# EAGLE design flute (EAGLE 6.1)
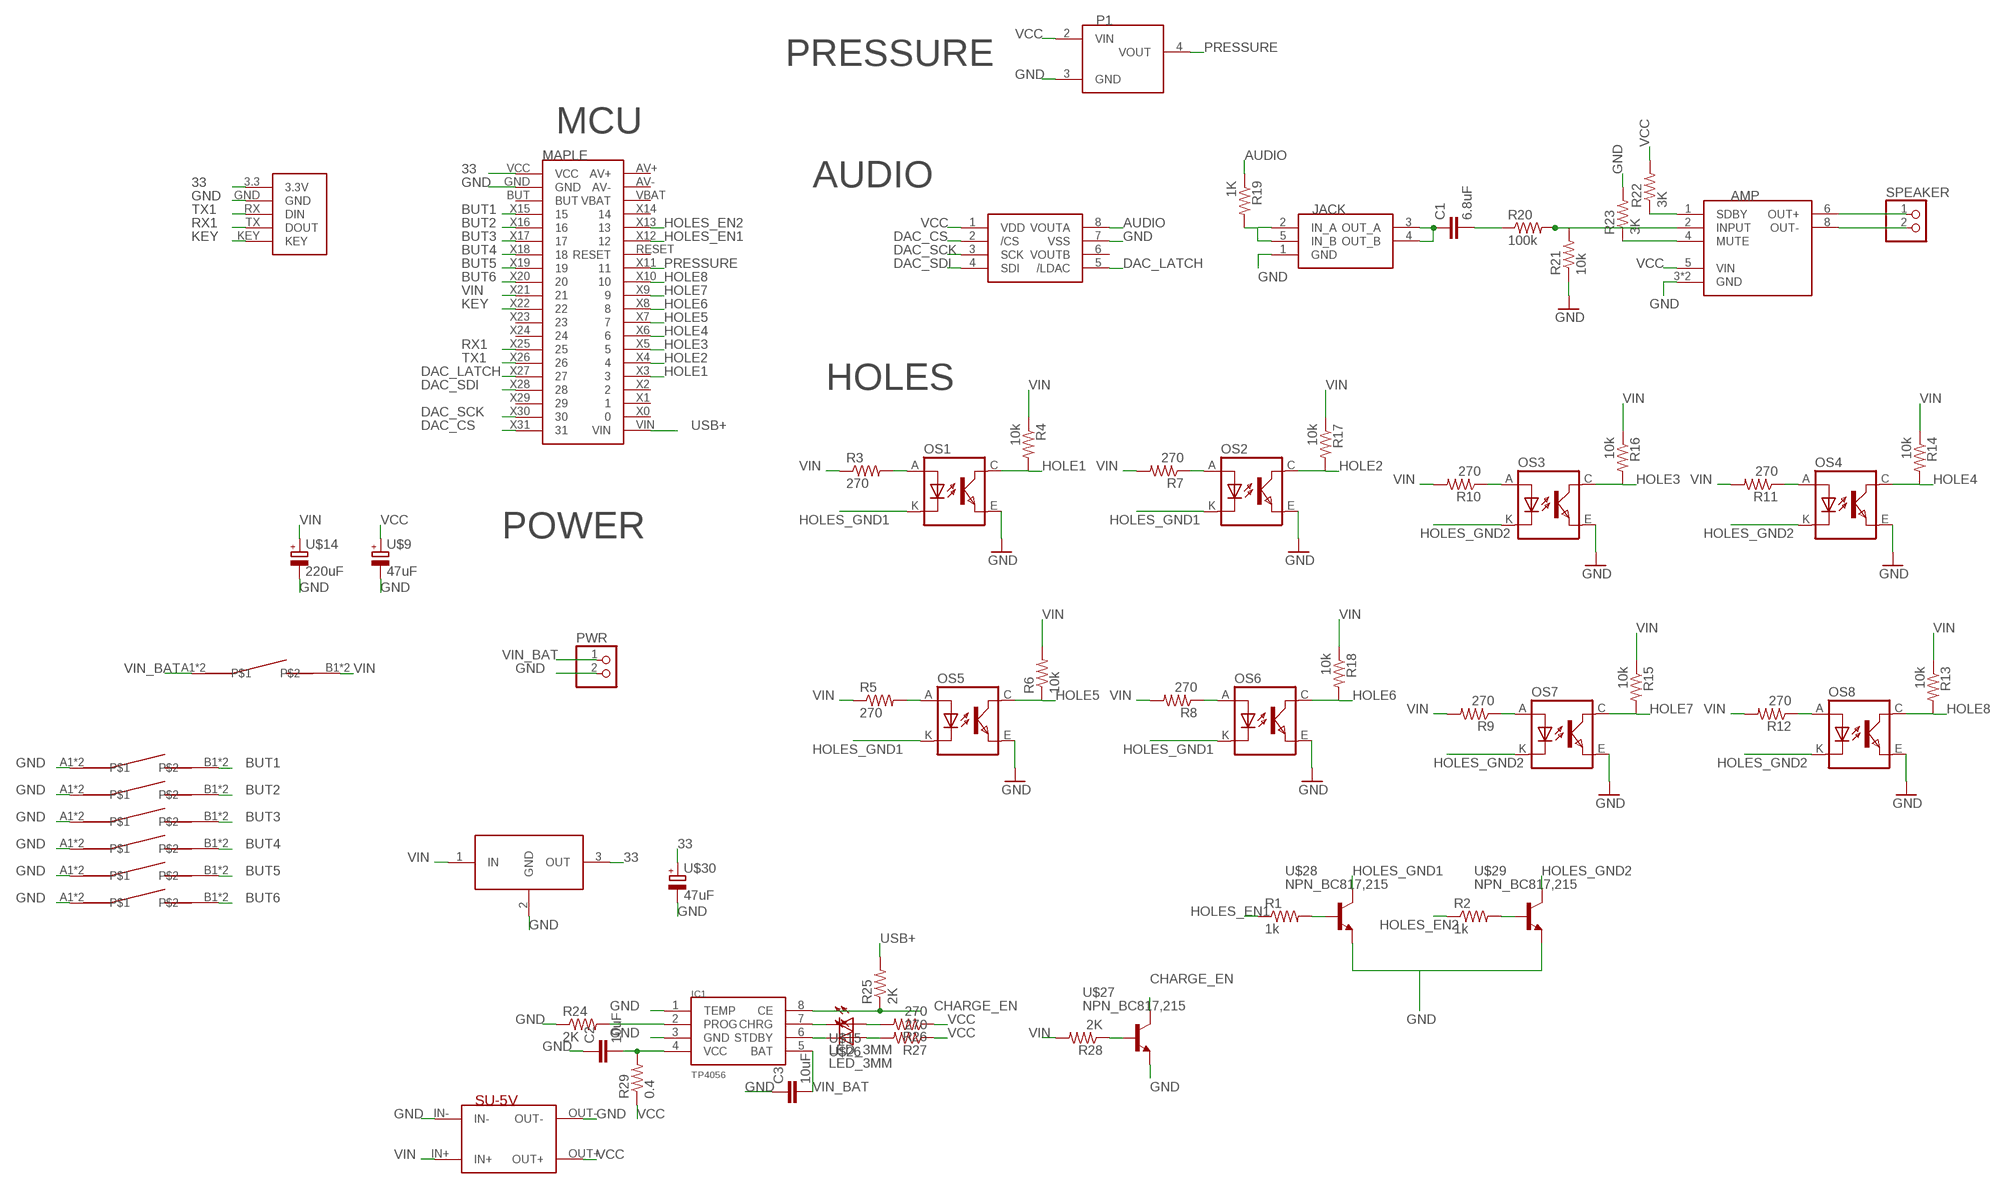
[diagram p0: schematic, sheet 1]

## Parts
AMP  AN7511DIP8  [DIL08]
C1  6.8uF  CAP0805  [0805]
C2  10uF  CAP0805  [0805]
C3  10uF  CAP0805  [0805]
IC1  TP4056  [SOP-8]
JACK  JACK  [3F07]
MAPLE  MAPLE_MINI  [CONNEC_2X20]
OS1  TCRT5000  [TCRT5000]
OS2  TCRT5000  [TCRT5000]
OS3  TCRT5000  [TCRT5000]
OS4  TCRT5000  [TCRT5000]
OS5  TCRT5000  [TCRT5000]
OS6  TCRT5000  [TCRT5000]
OS7  TCRT5000  [TCRT5000]
OS8  TCRT5000  [TCRT5000]
P1  PRESSURE_SENSOR  [MPXV5050GP]
PWR  CONNEC_1X02BASIC  [CONNEC_1X02]
R1  1k  RESISTOR0805-RES  [0805]
R2  1k  RESISTOR0805-RES  [0805]
R3  270  RESISTOR0805-RES  [0805]
R4  10k  RESISTOR0805-RES  [0805]
R5  270  RESISTOR0805-RES  [0805]
R6  10k  RESISTOR0805-RES  [0805]
R7  270  RESISTOR0805-RES  [0805]
R8  270  RESISTOR0805-RES  [0805]
R9  270  RESISTOR0805-RES  [0805]
R10  270  RESISTOR0805-RES  [0805]
R11  270  RESISTOR0805-RES  [0805]
R12  270  RESISTOR0805-RES  [0805]
R13  10k  RESISTOR0805-RES  [0805]
R14  10k  RESISTOR0805-RES  [0805]
R15  10k  RESISTOR0805-RES  [0805]
R16  10k  RESISTOR0805-RES  [0805]
R17  10k  RESISTOR0805-RES  [0805]
R18  10k  RESISTOR0805-RES  [0805]
R19  1K  RESISTOR0805-RES  [0805]
R20  100k  RESISTOR0805-RES  [0805]
R21  10k  RESISTOR0805-RES  [0805]
R22  3K  RESISTOR0805-RES  [0805]
R23  3K  RESISTOR0805-RES  [0805]
R24  2K  RESISTOR0805-RES  [0805]
R25  2K  RESISTOR0805-RES  [0805]
R26  270  RESISTOR0805-RES  [0805]
R27  270  RESISTOR0805-RES  [0805]
R28  2K  RESISTOR0805-RES  [0805]
R29  0.4  RESISTOR0805-RES  [0805]
SPEAKER  CONNEC_1X02BASIC  [CONNEC_1X02]
SU-5V  STEPUP-5V  [STEPUP-5V]
U$9  47uF  CPOL_EUPANASONIC_D  [PANASONIC_D]
U$14  220uF  CPOL_EUPANASONIC_D8  [PANASONIC_D8]
U$15  LED_3MM  [LED3MM]
U$16  SWITCHKCD11  [KCD11]
U$17  MCP4822  RHOBAN_MCP4822  [DIL08]
U$18  SWITCH6X6X10  [SWITCH_6X6X10]
U$19  SWITCH6X6X10  [SWITCH_6X6X10]
U$20  SWITCH6X6X10  [SWITCH_6X6X10]
U$21  SWITCH6X6X10  [SWITCH_6X6X10]
U$22  SWITCH6X6X10  [SWITCH_6X6X10]
U$23  SWITCH6X6X10  [SWITCH_6X6X10]
U$24  HC05  [HC-05]
U$25  MCP1703T-5002EDB  [SOT223]
U$26  LED_3MM  [LED3MM]
U$27  NPN_BC817,215  [SOT-23]
U$28  NPN_BC817,215  [SOT-23]
U$29  NPN_BC817,215  [SOT-23]
U$30  47uF  CPOL_EUPANASONIC_D  [PANASONIC_D]

## Nets
33: MAPLE.VCC U$24.3.3(3.3V) U$25.3(OUT) U$30.+
AUDIO: R19.1 U$17.8(VOUTA)
BUT1: MAPLE.X15 U$18.B1 U$18.B2
BUT2: MAPLE.X16 U$19.B1 U$19.B2
BUT3: MAPLE.X17 U$20.B1 U$20.B2
BUT4: MAPLE.X18 U$21.B1 U$21.B2
BUT5: MAPLE.X19 U$22.B1 U$22.B2
BUT6: MAPLE.X20 U$23.B1 U$23.B2
CHARGE_EN: IC1.8(CE) R25.1 U$27.3(C)
DAC_CS: MAPLE.X31 U$17.2(/CS)
DAC_LATCH: MAPLE.X27 U$17.5(/LDAC)
DAC_SCK: MAPLE.X30 U$17.3(SCK)
DAC_SDI: MAPLE.X28 U$17.4(SDI)
GND [alim]: AMP.3(GND) AMP.7(GND) C2.1 C3.1 IC1.1(TEMP) IC1.3(GND) JACK.1(GND) MAPLE.GND OS1.E(EMITTER) OS2.E(EMITTER) OS3.E(EMITTER) OS4.E(EMITTER) OS5.E(EMITTER) OS6.E(EMITTER) OS7.E(EMITTER) OS8.E(EMITTER) P1.3(GND) PWR.2 R21.1 R23.2 R24.1 SU-5V.IN- SU-5V.OUT- U$9.- U$14.- U$17.7(VSS) U$18.A1 U$18.A2 U$19.A1 U$19.A2 U$20.A1 U$20.A2 U$21.A1 U$21.A2 U$22.A1 U$22.A2 U$23.A1 U$23.A2 U$24.GND U$25.2(GND) U$27.2(E) U$28.2(E) U$29.2(E) U$30.-
HOLE1: MAPLE.X3 OS1.C(COLLECTOR) R4.2
HOLE2: MAPLE.X4 OS2.C(COLLECTOR) R17.2
HOLE3: MAPLE.X5 OS3.C(COLLECTOR) R16.2
HOLE4: MAPLE.X6 OS4.C(COLLECTOR) R14.2
HOLE5: MAPLE.X7 OS5.C(COLLECTOR) R6.1
HOLE6: MAPLE.X8 OS6.C(COLLECTOR) R18.2
HOLE7: MAPLE.X9 OS7.C(COLLECTOR) R15.2
HOLE8: MAPLE.X10 OS8.C(COLLECTOR) R13.2
HOLES_EN1: MAPLE.X12 R1.1
HOLES_EN2: MAPLE.X13 R2.1
HOLES_GND1: OS1.K(CATHODE) OS2.K(CATHODE) OS5.K(CATHODE) OS6.K(CATHODE) U$28.3(C)
HOLES_GND2: OS3.K(CATHODE) OS4.K(CATHODE) OS7.K(CATHODE) OS8.K(CATHODE) U$29.3(C)
KEY: MAPLE.X22 U$24.KEY
N$1: AMP.6(OUT+) SPEAKER.1
N$2: AMP.8(OUT-) SPEAKER.2
N$3: R1.2 U$28.1(B)
N$4: R2.2 U$29.1(B)
N$5: OS1.A(ANODE) R3.2
N$6: R27.2 U$26.A
N$7: OS2.A(ANODE) R7.1
N$8: JACK.2(IN_A) JACK.5(IN_B) R19.2
N$9: OS3.A(ANODE) R10.1
N$10: AMP.4(MUTE) R23.1
N$11: OS4.A(ANODE) R11.1
N$12: C1.2 R20.1
N$13: OS5.A(ANODE) R5.2
N$14: AMP.1(SDBY) R22.1
N$15: OS6.A(ANODE) R8.1
N$16: R26.2 U$15.A
N$17: OS7.A(ANODE) R9.1
N$18: AMP.2(INPUT) R20.2 R21.2
N$19: OS8.A(ANODE) R12.1
N$20: C1.1 JACK.3(OUT_A) JACK.4(OUT_B)
N$21: IC1.2(PROG) R24.2
N$22: R28.1 U$27.1(B)
N$23: C2.2 IC1.4(VCC) R29.2
N$24: IC1.7(CHRG) U$15.K(C)
N$25: IC1.6(STDBY) U$26.K(C)
PRESSURE: MAPLE.X11 P1.4(VOUT)
RX1: MAPLE.X25 U$24.TX(DOUT)
TX1: MAPLE.X26 U$24.RX(DIN)
USB+: MAPLE.VIN R25.2
VCC [alim]: AMP.5(VIN) P1.2(VIN) R22.2 R26.1 R27.1 R29.1 SU-5V.OUT+ U$9.+ U$17.1(VDD)
VIN [alim]: MAPLE.X21 R3.1 R4.1 R5.1 R6.2 R7.2 R8.2 R9.2 R10.2 R11.2 R12.2 R13.1 R14.1 R15.1 R16.1 R17.1 R18.1 R28.2 SU-5V.IN+ U$14.+ U$16.B1 U$16.B2 U$25.1(IN)
VIN_BAT [alim]: C3.2 IC1.5(BAT) PWR.1 U$16.A1 U$16.A2
Unconnected: MAPLE.AV+ MAPLE.AV- MAPLE.BUT MAPLE.RESET MAPLE.VBAT MAPLE.X0 MAPLE.X1 MAPLE.X2 MAPLE.X14 MAPLE.X23 MAPLE.X24 MAPLE.X29 U$17.6(VOUTB)

## Notes on the sheet
- PRESSURE
- MCU
- AUDIO
- HOLES
- POWER

## Library data of the parts
AMP = rhoban:AN7511
C1-C3 = SparkFun-Passives:CAP: Capacitor Standard 0603 ceramic capacitor, and 0.1" leaded capacitor.
IC1 = TP4056:TP4056
JACK = rhoban:JACK
MAPLE = rhoban:MAPLE_MINI
OS1-OS8 = tcrt5000:TCRT5000
P1 = rhoban:PRESSURE_SENSOR
PWR SPEAKER = rhoban:CONNEC_1X02
R1-R29 = SparkFun-Passives:RESISTOR: Resistor Basic schematic elements and footprints for 0603, 1206, and PTH resistors.
SU-5V = rhoban:STEPUP-5V
U$9 U$14 U$30 = rhoban:CPOL_EU: 47uF: http://fr.farnell.com/panasonic-electronic-components/eee1ca470sp/condensateur-elec-alu-47uf-16v/dp/9696946 220uF: http://fr.farnell.com/panasonic-electronic-components/eeefk1c221xp/condensateur-elec-alu-220uf-16v/dp/1850103
U$15 U$26 = rhoban:LED_3MM
U$16 U$18-U$23 = rhoban:SWITCH
U$17 = rhoban:RHOBAN_MCP4822
U$24 = rhoban:HC05
U$25 = rhoban:MCP1703T-5002EDB
U$27-U$29 = rhoban:NPN

## Net classes
0 default: width 0.305 mm
1 alim: width 0.508 mm, clearance 0.076 mm

## Board
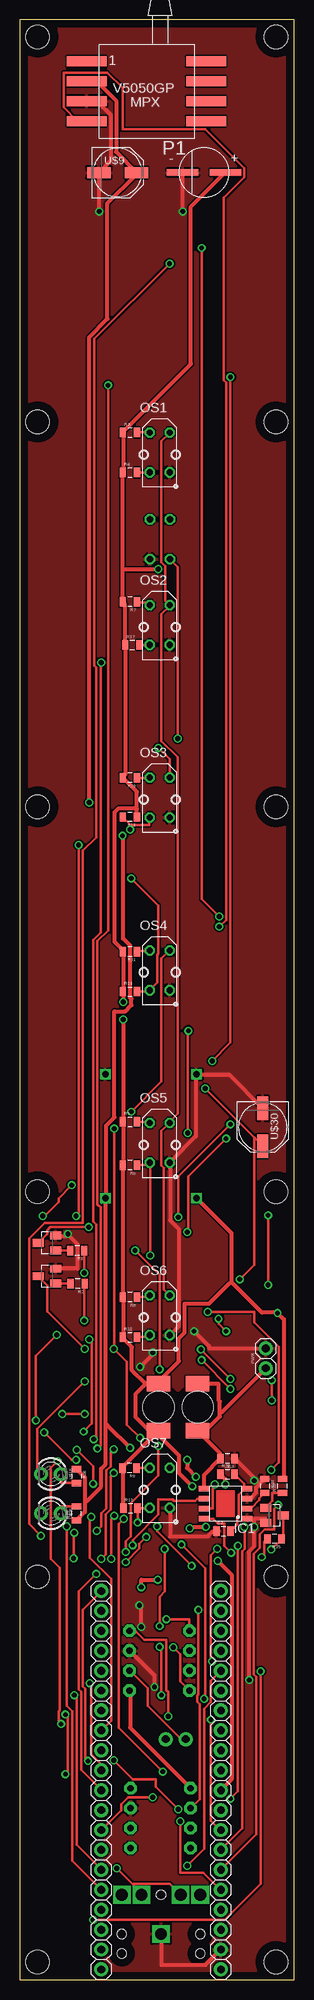
[diagram p1: board, top side]
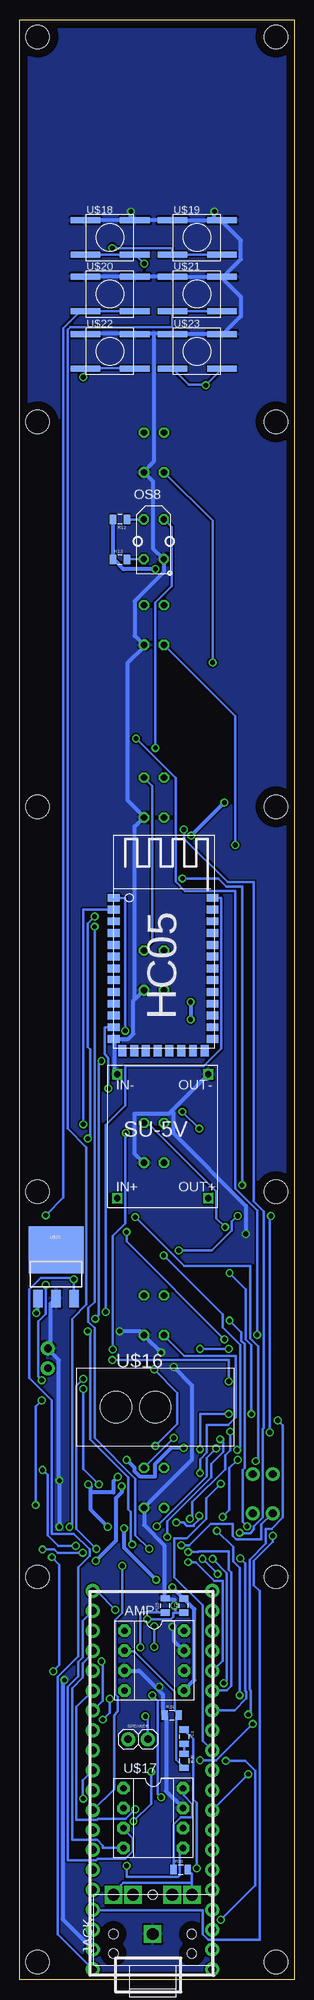
[diagram p2: board, bottom side, seen from below]

Size 35 x 250 mm. Coordinates in mm from the lower left corner, seen from the top.
Outline: 0,0 35,0 35,250 0,250 0,0
Copper layers (1*16): Top 0.035mm / dielectric 1.5mm / Bottom 0.035mm
Design rules: minimum track width 10mil, minimum drill 24mil, track to track 8mil, track to pad 8mil, pad to pad 8mil, via to via 8mil, smd to smd 8mil, copper to edge 40mil, drill to drill 8mil, minimum pad ring 10mil, minimum via ring 8mil, stop-mask expansion 4mil, vias tented up to drill 0mil, thermal gap 10mil

### Footprints (pad centres in the part's own frame; a part is rotated, then mirrored left to right if it is on the bottom)
DIL08 = drill 0.813 pad 1.6 octagon: 1 -3.81,-3.81; 2 -1.27,-3.81; 3 1.27,-3.81; 4 3.81,-3.81; 5 3.81,3.81; 6 1.27,3.81; 7 -1.27,3.81; 8 -3.81,3.81
0805 = smd 0.8 x 1.2: 1 -0.9,0; 2 0.9,0
SOP-8 = smd 1.3 x 0.7: 1 -2.75,1.905; 2 -2.75,0.635; 3 -2.75,-0.635; 4 -2.75,-1.905; 5 2.75,-1.905; 6 2.75,-0.635; 7 2.75,0.635; 8 2.75,1.905
3F07 = drill 1.5 square: 1 0,0; 2 5,5; 3 5,2.5; 4 5,-2.5; 5 5,-5 | hole 1.2: 5,0; 0,-5; -2.5,-5; -2.5,5; 0,5
CONNEC_2X20 = drill 1 pad 1.778: AV+ 0,0; AV- 2.54,0; BUT 5.08,-15.24; GND 2.54,-15.24; RESET 15.24,0; VBAT 5.08,0; VCC 0,-15.24; VIN 48.26,0; X0 45.72,0; X1 43.18,0; X2 40.64,0; X3 38.1,0; X4 35.56,0; X5 33.02,0; X6 30.48,0; X7 27.94,0; X8 25.4,0; X9 22.86,0; X10 20.32,0; X11 17.78,0; X12 12.7,0; X13 10.16,0; X14 7.62,0; X15 7.62,-15.24; X16 10.16,-15.24; X17 12.7,-15.24; X18 15.24,-15.24; X19 17.78,-15.24; X20 20.32,-15.24; X21 22.86,-15.24; X22 25.4,-15.24; X23 27.94,-15.24; X24 30.48,-15.24; X25 33.02,-15.24; X26 35.56,-15.24; X27 38.1,-15.24; X28 40.64,-15.24; X29 43.18,-15.24; X30 45.72,-15.24; X31 48.26,-15.24
TCRT5000 = drill 0.8 octagon: A -2.54,-1.27; C 2.54,-1.27; E 2.54,1.27; K -2.54,1.27
MPXV5050GP = smd 5.08 x 1.27: 1 15.24,0; 2 15.24,2.54; 3 15.24,5.08; 4 15.24,7.62; 5 0,7.62; 6 0,5.08; 7 0,2.54; 8 0,0
CONNEC_1X02 = drill 1 pad 1.778: 1 -1.27,1.27; 2 1.27,1.27
STEPUP-5V = drill 0.8 square: IN+ 1.2,1.2; IN- 1.2,17; OUT+ 12.8,1.2; OUT- 12.8,17
M3_HOLE = hole 3: 0,0
PANASONIC_D = smd 3 x 1.4: + 2.4,0; - -2.4,0
PANASONIC_D8 = smd 4.016 x 0.8: + 2.73,0; - -2.73,0
LED3MM = drill 1 pad 1.778: A -1.27,0; K 1.27,0
KCD11 = smd 3 x 2 bottom: A1 0,3; A2 0,-3; B1 5,3; B2 5,-3 | hole 4: 0,0; 5,0
SWITCH_6X6X10 = smd 3.81 x 0.75: A1 -0.1,5.2; A2 6.2,5.2; B1 -0.1,0.8; B2 6.2,0.8
HC-05 = smd 1.5 x 1: 3.3 0,-16.5; GND 0,-18; KEY 12.6,0; P$3 0,-3; P$4 0,-4.5; P$5 0,-6; P$6 0,-7.5; P$7 0,-9; P$8 0,-10.5; P$9 0,-12; P$10 0,-13.5; P$11 0,-15; P$23 12.6,-1.5; P$24 12.6,-3; P$25 12.6,-4.5; P$26 12.6,-6; P$27 12.6,-7.5; P$28 12.6,-9; P$29 12.6,-10.5; P$30 12.6,-12; P$31 12.6,-13.5; P$32 12.6,-15; P$33 12.6,-16.5; P$34 12.6,-18; RX 0,-1.5; TX 0,0 | smd 1 x 1.5: P$14 1.1,-19.5; P$15 2.6,-19.5; P$16 4.1,-19.5; P$17 5.6,-19.5; P$18 7.1,-19.5; P$19 8.6,-19.5; P$20 10.1,-19.5; P$21 11.6,-19.5
SOT223 = smd 1.219 x 2.235: 1 -2.311,-3.099; 2 0,-3.099; 3 2.311,-3.099 | smd 7 x 6: 4 0,3.099
SOT-23 = smd 1 x 1.4: 1 -0.95,-1.1; 2 0.95,-1.1; 3 0,1.1

### Placement (x,y rotation side)
AMP  17.83,40.71 270 bottom
C1  14.02,31.02 270 bottom
C2  26,57.25 0 top
C3  26.5,66.5 180 top
IC1  26.25,60.75 180 top
JACK  18.03,5.85 90 bottom
MAPLE  10.43,1.33 90 top
OS1  17.87,194.79 270 top
OS2  17.87,172.79 270 top
OS3  17.87,150.79 270 top
OS4  17.87,128.75 270 top
OS5  17.87,106.75 270 top
OS6  17.87,84.75 270 top
OS7  17.87,62.75 270 top
OS8  17.89,183.72 270 bottom
P1  23.78,244.67 180 top
PWR  32.66,79.28 90 top
R1  7.35,93.02 180 top
R2  7.4,88.78 180 top
R3  14.06,197.33 0 top
R4  14.06,192.25 0 top
R5  14.06,109.46 0 top
R6  14.06,103.88 180 top
R7  14.06,175.74 180 top
R8  14.06,87.06 180 top
R9  14.01,65.27 180 top
R10  14.06,153.28 180 top
R11  14.06,131.13 180 top
R12  22.2,186.24 180 bottom
R13  22.2,181.16 0 bottom
R14  14.06,126.05 0 top
R15  14.14,60.18 0 top
R16  14.06,148.3 180 top
R17  14.36,170.26 0 top
R18  14.06,81.98 0 top
R19  14.46,14.08 0 bottom
R20  14.02,27.94 270 bottom
R21  15.6,33.78 0 bottom
R22  14.08,47.73 90 bottom
R23  16.43,47.75 90 bottom
R24  31.25,63 270 top
R25  32.5,56.25 180 top
R26  7.25,64.25 270 top
R27  7.25,59.5 90 top
R28  33.5,63 90 top
R29  26.5,64.5 0 top
SPEAKER  19.9,29.44 0 bottom
SU-5V  23.75,98.5 0 bottom
U$1  [M3_HOLE]  2.3,2.3 0 top
U$2  [M3_HOLE]  2.3,51.4 0 top
U$3  [M3_HOLE]  32.7,2.3 0 top
U$4  [M3_HOLE]  32.7,51.4 0 top
U$5  [M3_HOLE]  2.3,100.5 0 top
U$6  [M3_HOLE]  32.7,100.5 0 top
U$7  [M3_HOLE]  2.3,149.6 0 top
U$8  [M3_HOLE]  32.7,149.6 0 top
U$9  12.5,230.5 0 top
U$10  [M3_HOLE]  2.3,198.7 0 top
U$11  [M3_HOLE]  32.7,198.7 0 top
U$12  [M3_HOLE]  2.3,247.8 0 top
U$13  [M3_HOLE]  32.7,247.8 0 top
U$14  23.5,230.5 0 top
U$15  4,64.5 180 top
U$16  22.7,73.05 0 bottom
U$17  17.97,20.63 270 bottom
U$18  26.5,219.2 0 bottom
U$19  15.4,219.2 0 bottom
U$20  26.5,212 0 bottom
U$21  15.4,212 0 bottom
U$22  26.5,204.7 0 bottom
U$23  15.4,204.7 0 bottom
U$24  23,138 0 bottom
U$25  30.35,90 0 bottom
U$26  4,59.5 180 top
U$27  32.5,59.25 270 top
U$28  3.5,94 90 top
U$29  3.5,89.75 90 top
U$30  31,108.75 270 top

### Tracks (layer width: path | path; a pad name or v marks a point on that pad's centre or on a via)
33  (via drill 0.61)
  Top 0.305: 30,107.36 30.96,106.4 U$30.+ | 30,107.36 v23.68,113.68 | v28.08,89.36 29.92,91.2 29.92,107.28 30,107.36
  Bottom 0.305: v23.68,113.68 23.68,117.6 24.16,118.08 24.16,121.44 23.04,121.44 U$24.3.3 | U$25.3 28.08,86.96 v28.08,89.36 28.16,89.44 28.16,89.52 32.32,89.52 33.76,88.08 33.76,76.8 30.88,73.92 30.88,56.88 28.08,56.88 26.08,54.88 26.08,54.08 27.52,52.64 27.52,41.28 30.16,38.64 30.16,5.84 25.68,1.36 MAPLE.VCC
AUDIO
  Bottom 0.305: R19.1 15.36,19.84 14.48,20.72 12.96,20.72 12.96,22.4 14.08,23.52 14.08,24.4 U$17.8
BUT1  (via drill 0.61)
  Top 0.305: v2.72,56.64 1.2,58.16 1.2,94.56 3.2,96.56 8.08,96.56 8.08,144 9.76,145.68 9.76,167.36 9.52,167.6 9.52,209.28 v19.12,218.88
  Bottom 0.305: v2.72,56.64 2.72,55.84 5.12,53.44 5.12,50.32 4.4,49.6 4.4,5.12 10.96,5.12 11.68,5.84 11.68,8.88 25.6,8.88 MAPLE.X15 | v19.12,218.88 20.24,220 U$18.B2 U$18.B1
BUT2  (via drill 0.61)
  Top 0.305: v20.48,20.24 20.48,13.68 23.44,13.68 25.6,11.52 MAPLE.X16 | v18.24,26.56 12.64,32.16 12.64,58.16 v13.28,58.8 | v8.16,69.92 9.2,70.96 9.2,81.36 v8.88,81.68 | v21.36,95.36 21.52,95.52 21.52,102.48 v26.32,107.28 | v25.44,135.6 23.2,137.84 v23.2,220.88
  Bottom 0.305: v20.48,20.24 18.24,22.48 v18.24,26.56 | v13.28,58.8 12.96,59.12 12.96,60.96 8.8,65.12 8.8,66.88 8.16,67.52 v8.16,69.92 | v8.88,81.68 21.36,94.16 v21.36,95.36 | v26.32,107.28 26,107.6 26,118.64 26.32,118.96 26.32,134.72 v25.44,135.6 | v23.2,220.88 15.52,220.88 15.52,220 U$19.B1 U$19.B2
BUT3  (via drill 0.61)
  Top 0.305: v32.96,60.56 32.48,60.08 32.48,57.44 31.28,57.44 30.64,56.8 30.64,55.12 29.84,54.32 29.84,38.96 30.16,38.64 30.16,18.56 25.68,14.08 MAPLE.X17 | v32.16,76.48 v32.16,73.92 | v31.68,97.52 v31.68,88.64
  Bottom 0.305: v32.96,60.56 32.96,73.12 v32.16,73.92 | v32.16,76.48 32.64,76.96 32.64,84 31.68,84.96 v31.68,88.64 | v31.68,97.52 29.44,99.76 29.44,210.64 27.28,212.8 U$20.B1 U$20.B2
BUT4  (via drill 0.61)
  Top 0.305: v28.64,57.76 28.72,57.68 28.72,54.96 28.4,54.64 28.4,19.36 25.68,16.64 MAPLE.X18
  Bottom 0.305: v28.64,57.76 28.32,58.08 28.32,84.32 26.48,86.16 26.48,106.16 28.88,108.56 28.88,210.48 28.56,210.8 15.52,210.8 15.52,212.8 U$21.B1 U$21.B2
BUT5  (via drill 0.61)
  Top 0.305: v24.4,33.2 24.4,20.32 25.6,19.12 MAPLE.X19 | v23.52,35.84 23.68,36 23.68,52.48 v20.64,55.52 | v26.32,82.72 25.36,83.68 v25.36,84.32 | v24.56,117.2 26.88,119.52 v26.88,204.4
  Bottom 0.305: v24.4,33.2 23.52,34.08 v23.52,35.84 | v20.64,55.52 20.8,55.68 20.8,59.68 21.12,60 21.12,64.08 26,68.96 26,82.4 v26.32,82.72 | v25.36,84.32 24.88,84.8 24.88,116.88 v24.56,117.2 | v26.88,204.4 26.64,204.64 26.64,205.44 U$22.B1 26.48,205.52 20.32,205.52 U$22.B2
BUT6  (via drill 0.61)
  Top 0.305: v21.92,52.8 17.52,57.2 v17.52,57.84 | v9.92,67.76 10.32,68.16 10.32,98.48 9.92,98.88 9.92,132.48 11.28,133.84 v11.28,203.36
  Bottom 0.305: v21.92,52.8 21.92,46.8 22.8,45.92 22.8,36.4 22.48,36.08 22.48,34.24 22.96,33.76 22.96,24.32 25.6,21.68 MAPLE.X20 | v17.52,57.84 11.12,64.24 11.12,66.56 v9.92,67.76 | U$23.B2 9.2,205.44 v11.28,203.36 11.36,203.44 13.44,203.44 U$23.B1
CHARGE_EN  (via drill 0.61)
  Top 0.305: U$27.3 33.6,56.48 33.44,56.32 R25.1 33.28,56.16 33.28,56.08 v32.08,54.88 | v26.96,54.48 26.08,55.36 26.08,58.24 25.28,58.24 24.72,58.8 23.52,58.8 IC1.8
  Bottom 0.305: v26.96,54.48 30.16,54.48 30.56,54.88 v32.08,54.88
DAC_CS  (via drill 0.61)
  Top 0.305: v22.8,47.2 22.8,36.4 22.64,36.24 22.64,35.44 22.96,35.12 22.96,23.04 21.84,21.92 U$17.2
  Bottom 0.305: v22.8,47.2 25.12,49.52 25.6,49.52 MAPLE.X31
DAC_LATCH  (via drill 0.61)
  Top 0.305: v21.36,14.56 23.52,16.72 23.52,34.56 24.4,35.44 24.4,38.16 25.6,39.36 MAPLE.X27
  Bottom 0.305: v21.36,14.56 21.36,13.12 14.8,13.12 14.56,13.36 14.56,16.4 14.16,16.8 U$17.5
DAC_SCK
  Bottom 0.305: U$17.3 21.76,19.28 20.56,18.08 20.56,16.4 21.52,15.44 25.04,15.44 25.2,15.28 28.88,15.28 28.88,37.36 27.52,38.72 27.52,40.56 26.96,41.12 26.96,45.76 MAPLE.X30
DAC_SDI
  Bottom 0.305: U$17.4 21.84,16.88 24.4,16.88 24.4,17.12 25.12,17.84 28.32,17.84 28.32,37.2 26.96,38.56 26.96,40.4 25.68,41.68 25.68,41.92 MAPLE.X28
GND  (via drill 0.61)
  Top 0.508: MAPLE.GND 25.6,3.84 23.68,1.92 18.08,1.92 18.08,5.84 JACK.1 | 29.92,58.8 31.36,58.8 31.36,58.32 U$27.2 | 29.92,58.8 29.04,58.8 IC1.1 | 30.64,63.28 30.16,62.8 30.16,62.16 29.44,61.44 29.04,61.44 IC1.3 | 30.64,63.28 31.2,63.84 R24.1 | 30.64,63.28 30.08,63.84 | 30.08,63.84 27.44,66.48 C3.1 | 29.92,58.8 v29.92,57.76 29.84,57.52 29.84,55.2 29.2,54.56 29.2,38.32 v29.28,38.24 | v29.92,63.68 30.08,63.84 | P1.3 8.56,239.52 9.92,239.52 11.6,237.84 11.6,232 U$9.- 10.16,230.32 v10.16,225.52 | v20.8,225.52 20.8,230.48 U$14.- | C2.1 25.04,57.2 24.64,57.2 24,56.56 19.2,56.56 19.2,60.16 OS7.E | v17.2,37.36 17.2,38.8 14.08,41.92 AMP.7 | v15.28,47.76 15.52,47.52 v15.52,45.04 | 6.16,94.88 4.64,94.88 U$28.2 | 6.16,94.88 6.32,94.88 7.36,93.84 7.36,90.72 4.64,90.72 U$29.2 | OS6.E 19.2,82.24 20.32,83.36 20.32,95.76 19.2,96.88 19.2,104.16 OS5.E 19.28,104.4 22.48,107.6 22.48,115.2 SU-5V.IN- 22.56,115.44 26.72,115.44 30.96,111.2 U$30.- | v6.16,95.12 6.16,94.88 | v15.36,78.16 16.96,79.76 v16.96,80 | v22.24,82.72 24.16,80.8 24.16,80.56 31.36,80.56 PWR.2
  Bottom 0.508: U$25.2 30.4,86.88 31.04,86.24 31.04,80.88 31.36,80.56 PWR.2 31.28,80.32 30,79.04 30,63.92 v29.92,63.68 v29.92,57.76 | v29.28,38.24 29.52,38 29.52,7.76 25.68,3.92 MAPLE.GND | U$19.A2 U$19.A1 U$18.A2 | U$18.A2 U$18.A1 | v20.8,225.52 20.8,224.64 U$18.A2 | v10.16,225.52 10.16,224.64 U$19.A2 | 17.92,209.92 15.76,209.92 U$23.A1 15.44,209.92 9.2,209.92 U$23.A2 8.96,210 6.8,212.16 6.8,214.64 9.12,216.96 U$21.A2 | 17.92,209.92 20.24,209.92 U$22.A2 20.56,209.92 26.56,209.92 U$22.A1 | U$21.A2 U$21.A1 U$20.A2 U$20.A1 | 17.92,209.92 17.92,193.6 19.04,192.48 OS1.E 19.12,192.24 18,191.12 18,182.56 16.64,181.2 OS8.E 16.64,180.96 16.64,179.52 20.32,175.84 20.32,171.44 19.2,170.32 OS2.E 19.2,170 21.2,168 21.2,150.4 19.28,148.48 OS3.E 19.2,148.24 20.32,147.12 20.32,125.36 20.16,125.2 | U$19.A2 9.12,224.16 6.8,221.84 6.8,219.44 8.96,217.28 U$21.A2 | 17.44,37.12 19.76,39.44 21.6,39.44 AMP.3 | 17.44,37.12 16.72,36.4 16.72,34 16.56,33.84 R21.1 16.32,33.6 16.32,24.08 14.16,21.92 U$17.7 | v17.2,37.36 17.44,37.12 | v15.28,47.76 15.28,48.48 16.24,48.48 R23.2 16.48,48.72 16.56,48.8 16.56,55.44 19.12,58 19.12,60.16 OS7.E 18.96,60.4 13.04,66.32 13.04,75.84 v15.36,78.16 | v15.52,45.04 15.28,44.8 15.28,43.2 14.08,42 AMP.7 | 15.6,110.8 15.92,110.48 20.32,110.48 20.32,105.36 19.2,104.24 OS5.E | 15.6,110.8 10.96,115.44 SU-5V.OUT- | v6.16,95.12 6.16,98.72 15.44,108 15.44,110.64 15.6,110.8 | SU-5V.IN- 22.56,115.52 22.88,115.84 22.88,119.92 22.96,120 U$24.GND 21.12,120 20.48,120.64 20.48,124.88 20.16,125.2 | 20.16,125.2 19.2,126.16 OS4.E | v16.96,80 19.12,82.16 OS6.E 19.28,82.4 19.28,82.72 v22.24,82.72
  pour Top: -12,294.5 69.75,294.5 69.75,-12.5 -36,-12.5 -36,198
  pour Bottom: -25.5,285.25 52.75,285.25 52.75,-18 -70.75,-18 -70.75,205
HOLE1  (via drill 0.61)
  Top 0.305: R4.2 16.56,192.24 OS1.C | v10.4,168 10.32,167.92 10.32,133.6 9.36,132.64 9.36,96.72 9.76,96.32 9.76,69.28 v9.44,68.96 | v16.16,56.48 15.28,55.6 15.28,55.04 v13.52,53.28
  Bottom 0.305: v10.4,168 10.4,186.08 16.56,192.24 OS1.C | v9.44,68.96 9.04,68.56 9.04,67.36 10.56,65.84 10.56,64.08 16.16,58.48 v16.16,56.48 | v13.52,53.28 12.56,53.28 10.16,50.88 9.12,50.88 9.12,40.72 10.4,39.44 MAPLE.X3
HOLE2  (via drill 0.61)
  Top 0.305: R17.2 15.28,170.24 16.56,170.24 OS2.C | v7.52,144.72 7.52,97.76 v7.2,97.44 | v14.72,93.04 17.84,89.92 v17.84,77.84 | v17.68,68.08 17.68,64.32 14.16,60.8 14.16,56.56 13.52,55.92 v13.52,54.56
  Bottom 0.305: v7.52,144.72 7.52,161.2 16.56,170.24 OS2.C | v7.2,97.44 7.92,96.72 7.92,95.6 10.48,93.04 v14.72,93.04 | v17.84,77.84 14.88,74.88 14.88,70.88 v17.68,68.08 | v13.52,54.56 12.24,54.56 12.16,54.64 8.32,54.64 8.32,52.32 8,52 8,37.52 8.56,36.96 10.4,36.96 MAPLE.X4
HOLE3  (via drill 0.61)
  Top 0.305: 14.16,147.28 13.2,148.24 R16.2 | 14.16,147.28 16.56,147.28 16.56,148.24 OS3.C | v14.08,146.72 14.08,147.2 14.16,147.28 | v6.96,57.04 6.88,56.96 v6.88,53.76
  Bottom 0.305: v14.08,146.72 14,146.64 14,145.52 8.48,140 5.12,140 5.12,99.28 3.84,98 3.84,70.4 4,70.24 4,58.96 5.12,57.84 5.12,57.44 5.6,56.96 6.96,56.96 v6.96,57.04 | v6.88,53.76 6.24,53.12 6.24,36.88 6.08,36.72 6.08,35.92 7.6,34.4 10.4,34.4 MAPLE.X5
HOLE4  (via drill 0.61)
  Top 0.305: R14.2 14.96,126.08 16.56,126.08 16.56,126.16 OS4.C 16.64,126.32 17.52,127.2 17.52,130.72 17.68,130.88 17.68,137.04 v14.24,140.48 | v6.64,101.36 4.96,99.68 4.96,99.2 3.2,97.44 v2.96,97.44 | v3.12,69.84 6.64,66.32 v7.2,66.32 | v9.12,59.04 8.96,58.88 8.96,53.84 11.68,51.12 11.68,33.04 10.48,31.84 MAPLE.X6
  Bottom 0.305: v14.24,140.48 9.68,140.48 8.64,139.44 6.64,139.44 v6.64,101.36 | v2.96,97.44 3.12,97.28 v3.12,69.84 | v7.2,66.32 8.24,65.28 8.24,59.92 v9.12,59.04
HOLE5  (via drill 0.61)
  Top 0.305: R6.1 14.96,103.92 16.56,103.92 16.56,104.16 OS5.C 16.64,103.84 v16.64,92.4 | v7.28,67.6 9.36,65.52 v9.36,63.28
  Bottom 0.305: v16.64,92.4 9.12,84.88 9.12,83.2 6.88,80.96 6.88,68 v7.28,67.6 | v9.36,63.28 11.2,61.44 11.2,58.8 13.68,56.32 15.28,56.32 15.28,51.36 11.68,47.76 11.68,30.48 10.48,29.28 MAPLE.X7
HOLE6  (via drill 0.61)
  Top 0.305: R18.2 14.96,82 16.56,82 16.56,82.16 OS6.C | v12,64.64 11.6,64.24 11.6,60 10.96,59.36 10.96,54.24 v10.4,53.68 | v8.96,37.84 9.12,37.68 9.12,28.8 10.4,27.52 10.4,26.8 MAPLE.X8
  Bottom 0.305: v12,64.64 12,66.4 11.12,67.28 11.12,70.8 8.4,70.8 7.44,71.76 7.44,79.6 14,79.6 16.56,82.16 OS6.C | v10.4,53.68 8.56,51.84 8.56,38.24 v8.96,37.84
HOLE7  (via drill 0.61)
  Top 0.305: OS7.C 16.56,60.16 15.12,60.16 R15.2 15.04,60.08 v15.04,58.32 | v12.08,59.2 11.68,58.8 v11.68,53.68 | v9.76,51.76 7.52,49.52 7.52,37.04 7.84,36.72 7.84,26.8 10.4,24.24 MAPLE.X9
  Bottom 0.305: v15.04,58.32 14.08,58.32 13.68,57.92 12.8,57.92 12.8,58 12.08,58.72 v12.08,59.2 | v9.76,51.76 v11.68,53.68
HOLE8  (via drill 0.61)
  Top 0.305: v20.16,158.32 20.16,180.16 19.2,181.12 OS8.C | v4.72,82.24 2.08,79.6 v2.08,71.36 | v5.84,33.84 6.16,33.52 6.16,26.56 v5.84,26.24
  Bottom 0.305: R13.2 21.28,181.2 19.2,181.2 OS8.C | v20.16,158.32 15.12,153.28 15.12,140.08 13.92,138.88 7.52,138.88 7.52,100.96 4.72,98.16 v4.72,82.24 | v2.08,71.36 1.44,70.72 1.44,58.96 2.88,57.52 3.6,57.52 3.6,55.68 5.68,53.6 5.68,37.04 5.52,36.88 5.52,34.16 v5.84,33.84 | v5.84,26.24 10.4,21.68 MAPLE.X10
HOLES_EN1  (via drill 0.61)
  Top 0.305: v8.24,90.16 8.24,92.96 R1.1 | v8.32,72.16 v5.44,72.16 | v12,67.68 11.6,67.28 11.6,65.52 11.04,64.96 11.04,60.16 10.4,59.52 10.4,57.84 v9.84,57.28 | v6.96,36.32 7.28,36 7.28,17.2 10.4,14.08 MAPLE.X12
  Bottom 0.305: v8.24,90.16 6.16,88.08 6.16,81.68 5.44,80.96 v5.44,72.16 | v8.32,72.16 12,72.16 v12,67.68 | v9.84,57.28 7.76,55.2 7.76,53.36 6.96,52.56 v6.96,36.32
HOLES_EN2  (via drill 0.61)
  Top 0.305: v8.24,84.08 8.24,88.72 R2.1 | v6,57.84 6,34.96 6.72,34.24 6.72,15.2 10.4,11.52 MAPLE.X13
  Bottom 0.305: v8.24,84.08 6.72,82.56 6.72,81.52 6.32,81.12 6.32,65.28 6.56,65.04 6.56,58.4 v6,57.84
HOLES_GND1  (via drill 0.61)
  Top 0.305: OS1.K 19.12,197.28 18.08,196.24 18.08,180.8 18.56,180.32 18.56,175.92 19.12,175.36 OS2.K 19.12,175.2 18.08,174.16 18.08,158 20.16,155.92 20.16,110.48 19.12,109.44 OS5.K 19.12,109.28 18.08,108.24 18.08,103.84 18.4,103.52 18.4,88.08 19.12,87.36 OS6.K | U$28.3 3.52,95.12 3.52,95.6 3.92,96 v8.8,96
  Bottom 0.305: v8.8,96 9.92,97.12 9.92,100.56 18.64,109.28 19.12,109.28 OS5.K
HOLES_GND2  (via drill 0.61)
  Top 0.305: v8.32,80.48 3.52,85.28 3.52,88.56 2.4,89.68 U$29.3 | v15.36,69.12 13.68,70.8 13.68,78.8 v12,80.48 12.08,80.56 v12.08,108.56 | v17.68,157.12 19.12,155.68 19.12,153.36 OS3.K | v14.24,110.72 18.08,114.56 18.08,130.24 19.12,131.28 OS4.K
  Bottom 0.305: v12,80.48 v8.32,80.48 | v15.36,69.12 19.12,65.36 OS7.K | OS4.K 19.12,131.36 18.08,132.4 18.08,152.24 19.12,153.28 OS3.K | v17.68,157.12 17.68,175.68 15.6,177.76 15.6,185.28 16.56,186.24 OS8.K | v14.24,110.72 v12.08,108.56
KEY  (via drill 0.61)
  Top 0.305: v24,85.2 29.92,85.2 29.92,83.84 33.04,80.72 33.04,66 v32.08,65.04 | v27.84,55.36 27.84,24.08 v26.88,23.12
  Bottom 0.305: U$24.KEY 9.28,138 9.28,118.8 11.52,116.56 21.52,116.56 21.52,111.52 24,109.04 v24,85.2 | v32.08,65.04 31.44,64.4 31.44,56.72 30.08,55.36 v27.84,55.36 | v26.88,23.12 26.96,23.2 26.96,25.44 MAPLE.X22
N$1
  Top 0.305: AMP.6 14.08,39.44 16.32,37.2 16.32,34.96 20.56,30.72 21.12,30.72 SPEAKER.1
N$2  (via drill 0.61)
  Top 0.305: v18.96,33.6 18.96,36.72 18.72,36.96 18.72,43.36 15.92,43.36 14.8,44.48 14.08,44.48 AMP.8
  Bottom 0.305: v18.96,33.6 18.64,33.28 SPEAKER.2
N$3
  Top 0.305: R1.2 6.4,93.04 4.64,93.04 U$28.1
N$4
  Top 0.305: U$29.1 6.48,88.8 R2.2
N$5
  Top 0.305: R3.2 14.96,197.36 16.56,197.36 OS1.A
N$6
  Top 0.305: R27.2 5.28,60.4 5.28,59.52 U$26.A
N$7
  Top 0.305: R7.1 14.96,175.68 16.56,175.68 16.56,175.36 OS2.A
N$8
  Bottom 0.305: 13.04,12.4 13.04,10.88 JACK.5 | 13.04,12.4 13.04,13.52 13.52,14 R19.2 | 13.04,12.4 21.76,12.4 22.08,12.08 22.08,11.76 22.96,10.88 JACK.2
N$9
  Top 0.305: R10.1 16.56,153.28 OS3.A
N$10  (via drill 0.61)
  Top 0.305: v19.6,42.4 20.48,41.52 20.48,38.08 21.6,36.96 AMP.4
  Bottom 0.305: v19.6,42.4 19.6,46.88 16.48,46.88 R23.1
N$11
  Top 0.305: R11.1 14.96,131.2 16.56,131.2 16.56,131.28 OS4.A
N$12
  Bottom 0.305: R20.1 14,28.88 14,30.08 C1.2
N$13
  Top 0.305: R5.2 14.96,109.44 16.56,109.44 16.56,109.36 OS5.A
N$14  (via drill 0.61)
  Top 0.305: v18.72,46 21.6,46 21.6,44.56 AMP.1
  Bottom 0.305: v18.72,46 15.76,46 15.44,46.32 15.44,46.8 14.08,46.8 R22.1
N$15
  Top 0.305: R8.1 14.96,87.12 16.56,87.12 16.56,87.28 OS6.A
N$16
  Top 0.305: R26.2 7.2,63.36 5.28,63.36 5.28,64.48 U$15.A
N$17
  Top 0.305: R9.1 14.96,65.28 16.56,65.28 OS7.A
N$18
  Bottom 0.305: R20.2 14.08,27.12 15.04,28.08 15.04,33.44 14.72,33.76 R21.2 14.72,33.92 15.2,34.4 15.2,36.72 20.4,41.92 21.6,41.92 AMP.2
N$19
  Bottom 0.305: R12.1 21.28,186.24 19.2,186.24 OS8.A
N$20  (via drill 0.61)
  Top 0.305: 14.48,12.16 15.52,11.12 15.52,10.88 JACK.4 | 14.48,12.16 v12.4,14.24 | JACK.3 20.48,10.88 19.12,12.24 14.56,12.24 14.48,12.16
  Bottom 0.305: v12.4,14.24 12.4,22.56 12.88,23.04 12.88,30.72 14,31.84 C1.1
N$21
  Top 0.305: R24.2 31.2,62.08 30.56,61.44 30.56,61.2 29.52,60.16 29.04,60.16 IC1.2
N$22
  Top 0.305: R28.1 33.44,62.08 32.24,62.08 32.24,61.12 31.44,60.32 31.44,60.24 U$27.1
N$23
  Top 0.305: C2.2 26.96,57.28 27.76,58.08 27.76,58.8 27.92,58.96 27.92,61.84 28.72,62.64 28.96,62.64 IC1.4 28.64,62.72 28.64,63.28 27.44,64.48 R29.2
N$24  (via drill 0.61)
  Top 0.305: v24.88,63.2 24.64,62.96 24.64,60.16 23.52,60.16 IC1.7 | v23.2,79.04 v26.88,75.36 | v8.32,76.32 2.24,70.24 2.24,65.04 2.72,64.56 U$15.K
  Bottom 0.305: v24.88,63.2 26.88,65.2 v26.88,75.36 | v23.2,79.04 8.32,79.04 v8.32,76.32
N$25  (via drill 0.61)
  Top 0.305: v14.4,55.44 14.4,56.08 17.68,59.36 17.68,61.28 19.52,61.28 19.68,61.12 22.4,61.12 22.64,61.36 23.44,61.36 IC1.6
  Bottom 0.305: v14.4,55.44 13.36,55.44 10.64,58.16 7.84,58.16 7.84,56.64 7.36,56.16 4.16,56.16 4.16,58.08 2.8,59.44 U$26.K
PRESSURE  (via drill 0.61)
  Top 0.305: v16.96,23.28 13.84,23.28 12.96,22.4 12.96,21.6 10.48,19.12 MAPLE.X11 | v18.08,36.32 18.08,42.24 v17.84,42.48 | v17.84,45.12 17.84,48.88 18.48,49.52 v18.48,54.96 | v25.44,134.32 26.32,135.2 26.32,203.68 26,204 26,227.28 28.64,229.92 28.64,231.04 23.68,236 13.12,236 13.12,241.28 11.2,243.2 5.6,243.2 5.6,238.8 7.28,237.12 8.48,237.12 P1.4
  Bottom 0.305: v16.96,23.28 17.36,23.68 17.36,35.6 v18.08,36.32 | v17.84,45.12 v17.84,42.48 | v18.48,54.96 20.24,56.72 20.24,63.92 25.44,69.12 25.44,83.12 26.24,83.92 26.24,85.68 25.44,86.48 v25.44,134.32
RX1  (via drill 0.61)
  Top 0.305: v21.52,121.04 21.44,120.96 v21.44,108 | v26.88,76.64 v23.12,80.4 | v25.2,54.96 24.4,54.16 24.4,40.8 v24.56,40.64
  Bottom 0.305: U$24.TX 21.52,138 v21.52,121.04 | v21.44,108 21.52,107.92 21.52,96.48 23.12,94.88 v23.12,80.4 | v26.88,76.64 27.76,75.76 27.76,57.52 v25.2,54.96 | v24.56,40.64 24.4,40.48 24.4,35.6 25.6,34.4 MAPLE.X25
TX1  (via drill 0.61)
  Top 0.305: v26.88,109.12 20.24,102.48 v20.24,97.28 | v4.88,66.16 4,65.28 4,53.68 5.12,52.56 5.12,34.4 4.96,34.24 4.96,32.96 v5.28,32.64 | v12,28 14.4,25.6 17.36,25.6 17.36,24.64 v20.24,21.76
  Bottom 0.305: v26.88,109.12 26.88,136.48 23.04,136.48 U$24.RX | v20.24,97.28 14,91.04 5.6,91.04 5.6,81.84 4.56,80.8 4.56,66.48 v4.88,66.16 | v5.28,32.64 9.92,28 v12,28 | v20.24,21.76 21.44,20.56 24.96,20.56 25.12,20.4 27.76,20.4 27.76,34.8 MAPLE.X26
USB+  (via drill 0.61)
  Top 0.305: v30.88,53.92 31.2,54.24 31.2,55.84 R25.2 | v30.72,39.36 30.72,12.24 26.16,7.68 v9.36,7.68 | v8.72,27.92 8.4,28.24 8.4,37.12 8.08,37.44 8.08,47.2 10.4,49.52 MAPLE.VIN
  Bottom 0.305: v30.88,53.92 29.92,52.96 29.92,40.16 v30.72,39.36 | v9.36,7.68 4.96,12.08 4.96,26.64 6.24,27.92 v8.72,27.92
VCC  (via drill 0.61)
  Top 0.508: v26.24,63.2 26.24,63.84 25.6,64.48 R29.1 | v23.76,57.76 21.68,57.76 v21.68,57.6 | v17.6,51.04 15.52,51.04 v15.52,50.08 | U$17.1 21.76,24.48 14.08,32.16 14.08,36.88 AMP.5 | P1.2 8.56,242.08 9.92,242.08 12.32,239.68 12.32,233.12 14.88,230.56 U$9.+ 14.88,230.24 11.2,226.56 11.2,211.84 8.88,209.52 v8.88,150.16 | 8.32,61.04 8.32,64.08 R26.1 | 8.32,61.04 8.32,59.68 7.28,58.64 R27.1 | 10.96,70.72 10.96,65.76 10.4,65.2 10.4,62.88 8.56,61.04 8.32,61.04 | 10.96,70.72 10.96,99.68 SU-5V.OUT+ 11.04,99.92 11.04,108.96 12.08,110 12.08,123.52 13.44,123.52 14.24,124.32 14.24,125.12 14.08,125.28 14.08,131.92 13.2,132.8 13.2,145.84 v13.12,145.92 | v22.48,64.16 21.36,65.28 v21.36,66.32 | v14.08,67.84 11.2,70.72 10.96,70.72
  Bottom 0.508: AMP.5 14,36.96 12.72,38.24 12.72,47.28 14,48.56 R22.2 14.24,48.8 v15.52,50.08 | v26.24,63.2 25.92,62.88 25.92,62.16 | 25.92,62.16 25.92,59.92 v23.76,57.76 | v21.68,57.6 21.68,55.12 v17.6,51.04 | v13.12,145.92 v8.88,150.16 | 25.92,62.16 23.04,62.16 23.04,63.6 v22.48,64.16 | v21.36,66.32 20.32,65.28 20.32,64.88 19.6,64.16 17.76,64.16 17.76,65.76 15.68,67.84 v14.08,67.84
VIN  (via drill 0.61)
  Top 0.508: R28.2 33.68,64.08 33.68,84.24 v32.88,85.04 32.64,85.12 30.88,85.12 27.04,88.96 | 27.04,88.96 27.04,95.2 22.56,99.68 SU-5V.IN+ | 16,76.08 14.32,77.76 14.32,80.72 13.28,81.76 R18.1 13.2,82 13.2,87.04 R8.2 13.2,87.28 13.2,103.68 R6.2 13.2,103.92 13.2,109.44 R5.1 13.2,109.68 v13.2,122.48 | 16,76.08 17.68,76.08 U$16.B1 17.76,76.32 20.32,78.88 20.32,81.84 21.04,82.56 21.04,86.24 24.16,86.24 26.8,88.88 27.04,88.96 | R15.1 13.2,60.24 13.2,65.12 13.12,65.2 R9.2 13.2,65.52 17.68,70 U$16.B2 | v25.28,53.44 27.04,51.68 27.04,25.6 25.68,24.24 MAPLE.X21 | v22,62.96 20.32,64.64 20.32,66.88 17.6,69.6 U$16.B2 | 16,76.08 15.92,75.84 14.8,74.72 14.8,71.76 16.96,69.6 U$16.B2 | R16.1 14.96,149.36 | 14.96,149.36 14.96,151.52 13.2,153.28 R10.2 13.28,153.52 13.44,153.68 13.44,170 R17.1 13.44,170.32 13.44,175.44 13.2,175.68 R7.2 13.12,176 13.12,179.92 | 14.96,149.36 12.56,149.36 12.08,148.88 12.08,132.4 13.12,131.36 R11.2 13.2,131.12 13.2,126.08 R14.1 13.2,125.84 v13.2,124.72 | 13.12,179.92 13.12,192 R4.1 13.2,192.32 13.2,197.28 R3.1 13.28,197.52 21.84,206.08 21.84,226.16 26.16,230.48 U$14.+ | 13.12,179.92 v17.68,179.92
  Bottom 0.508: v32.88,85.04 32.72,85.2 32.72,86.88 U$25.1 | v25.28,53.44 22.72,56 22.72,61.44 22,62.16 v22,62.96 | R12.2 23.12,186.24 23.12,181.2 R13.1 22.88,181.04 21.76,179.92 v17.68,179.92 | v13.2,124.72 v13.2,122.48
VIN_BAT
  Top 0.508: IC1.5 23.52,62.72 23.52,64.4 25.6,66.48 C3.2 25.52,66.72 25.52,67.2 22.72,70 U$16.A2 23.36,69.68 25.52,71.84 25.52,72.4 | 25.52,72.4 25.52,73.76 25.36,73.92 25.36,76 22.72,76 U$16.A1 | PWR.1 31.36,78 25.76,72.4 25.52,72.4